# EAGLE design PolluxSensorBoard (EAGLE 6.1)
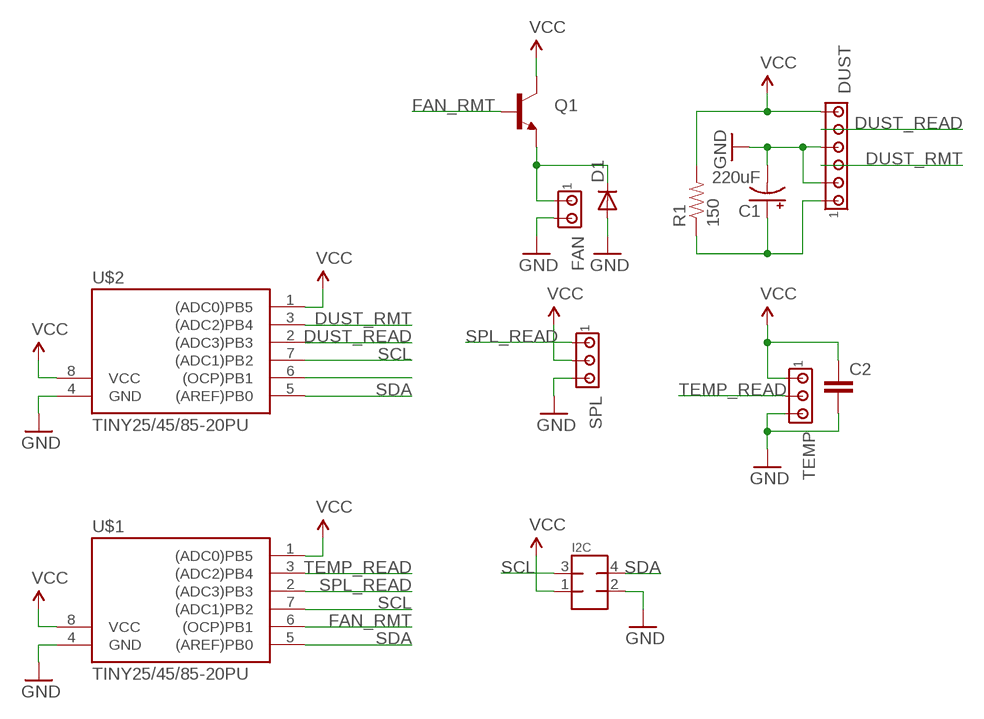
[diagram p0: schematic, sheet 1]

## Parts
C1  220uF  CAP_POLPTH4  [CPOL-RADIAL-1000UF-25V]
C2  CAPPTH1  [CAP-PTH-5MM]
D1  DIODEPTH  [DIODE-1N4001]
DUST  MTA06-100  [10X06MTA]
FAN  MTA02-100  [10X02MTA]
I2C  MMATCH-8-PTH  [AMP-215079-8]
Q1  TRANSISTOR_NPNTO-92-AMMO  [TO-92-AMMO]
R1  150  RESISTORPTH-1/4W  [AXIAL-0.4]
SPL  MTA03-100  [10X03MTA]
TEMP  MTA03-100  [10X03MTA]
U$1  TINY25/45/85-20PU  [DIL08]
U$2  TINY25/45/85-20PU  [DIL08]

## Nets
DUST_READ: DUST.2 U$2.2((ADC3)PB3)
DUST_RMT: DUST.4 U$2.3((ADC2)PB4)
FAN_RMT: Q1.2(B) U$1.6((OCP)PB1)
GND: C1.2(-) C2.2 D1.A DUST.3 DUST.5 FAN.2 I2C.2 SPL.3 TEMP.3 U$1.4(GND) U$2.4(GND)
N$1: D1.C FAN.1 Q1.1(E)
N$3: C1.1(+) DUST.6 R1.P$1
N$6: U$2.6((OCP)PB1)
SCL: I2C.3 U$1.7((ADC1)PB2) U$2.7((ADC1)PB2)
SDA: I2C.4 U$1.5((AREF)PB0) U$2.5((AREF)PB0)
SPL_READ: SPL.1 U$1.2((ADC3)PB3)
TEMP_READ: TEMP.2 U$1.3((ADC2)PB4)
VCC: C2.1 DUST.1 I2C.1 Q1.3(C) R1.P$2 SPL.2 TEMP.1 U$1.1((ADC0)PB5) U$1.8(VCC) U$2.1((ADC0)PB5) U$2.8(VCC)

## Library data of the parts
C1 = SparkFun:CAP_POL: Capacitor Polarized These are standard SMD and PTH capacitors. Normally 10uF, 47uF, and 100uF in electrolytic and tantalum varieties. Always verify the external diameter of the through hole cap, it varies with capacity, voltage, and manufacturer. The EIA devices should be standard.
C2 = SparkFun:CAP: Capacitor Standard 0603 ceramic capacitor, and 0.1" leaded capacitor.
D1 = SparkFun:DIODE: Diode These are standard reverse protection diodes and small signal diodes. SMA package can handle up to about 1A. SOD-323 can handle about 200mA. What the SOD-323 package when ordering, there are some mfgs out there that are 5-pin packages.
DUST = con-amp:MTA06-100: AMP connector
FAN = con-amp:MTA02-100: AMP connector
I2C = jt-con-micromatch:MMATCH-8-*: AMP Micromatch 8-pin
Q1 = SparkFun:TRANSISTOR_NPN: Transistor NPN BJT configuration in SOT23 package. MMBT2222 is the common NPN we use. Double check BCE configuration again layout.
R1 = SparkFun:RESISTOR: Resistor Basic schematic elements and footprints for 0603, 1206, and PTH resistors.
SPL TEMP = con-amp:MTA03-100: AMP connector
U$1 U$2 = avr-7:TINY25/45/85

## Board
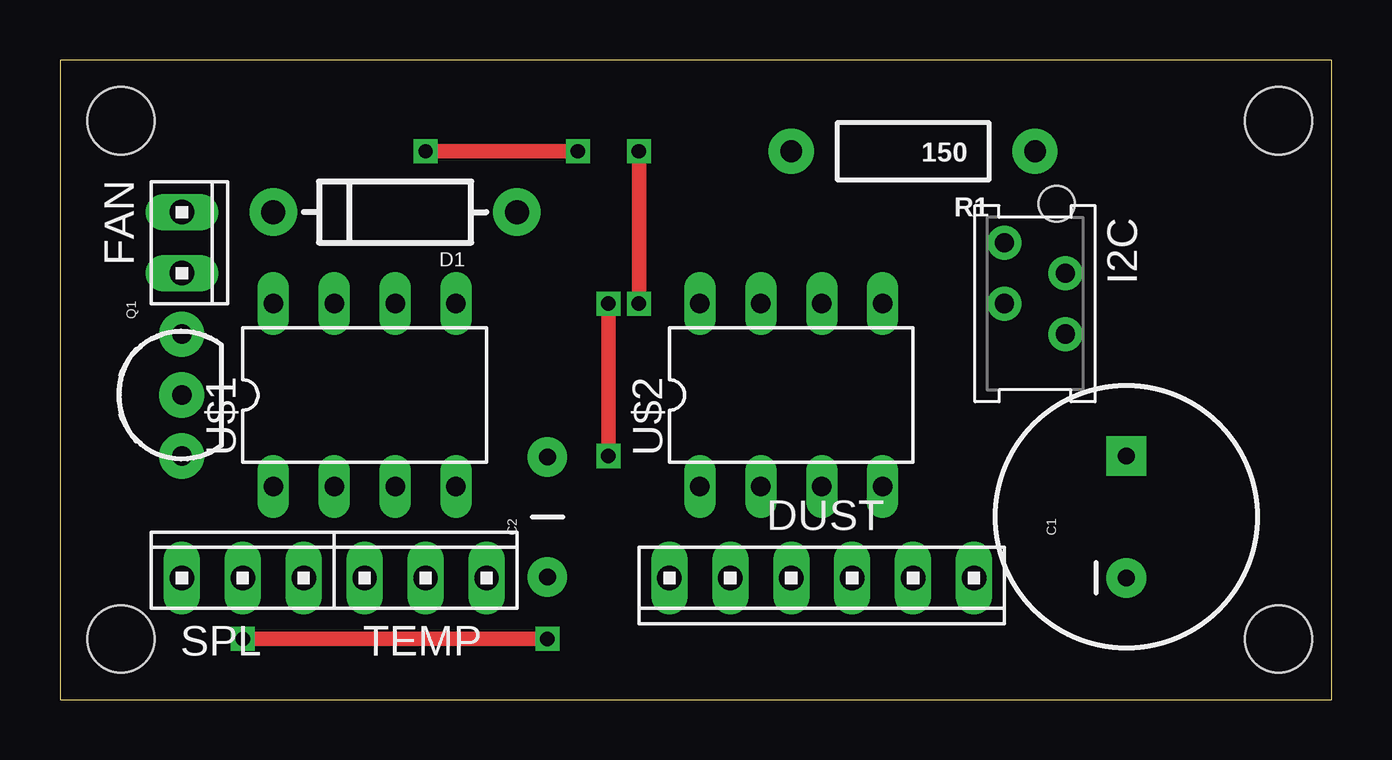
[diagram p1: board, top side]
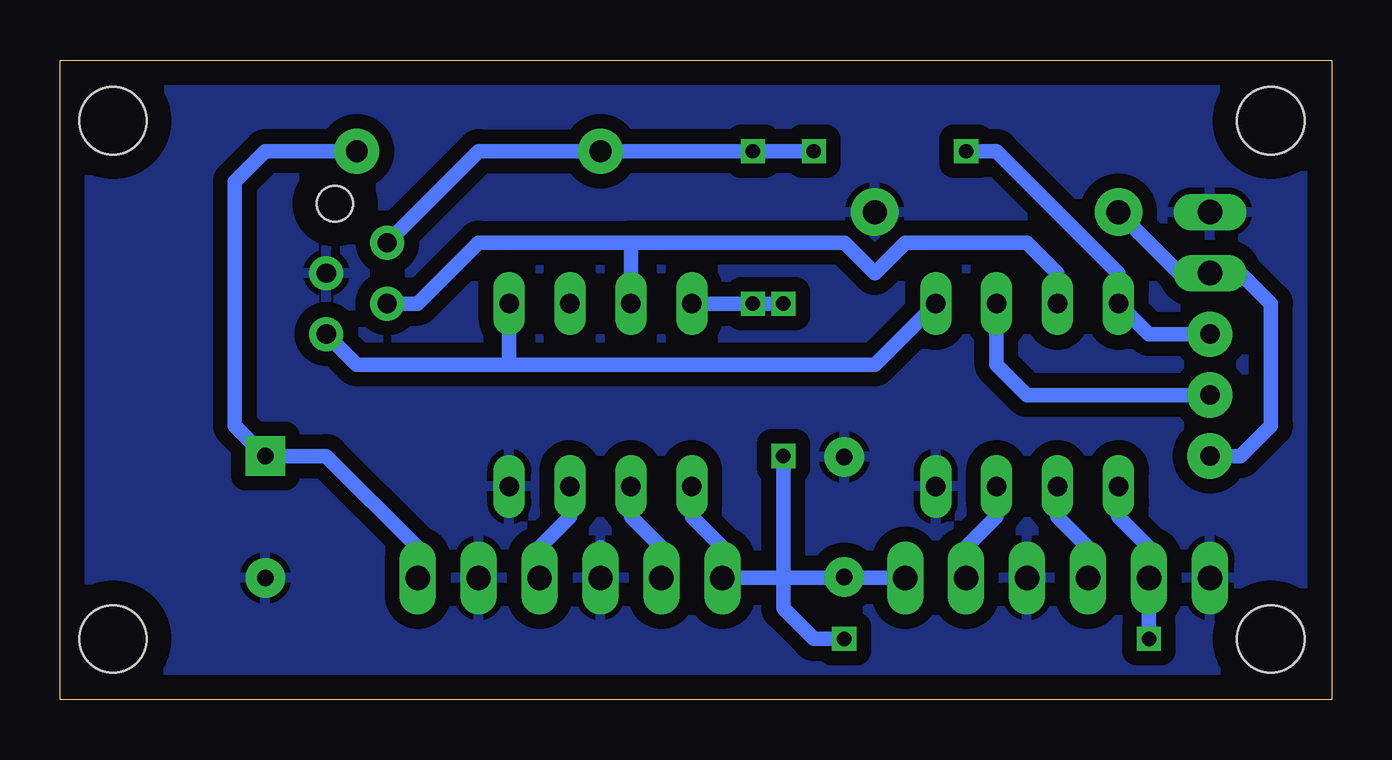
[diagram p2: board, bottom side, seen from below]

Size 53.01 x 26.66 mm. Coordinates in mm from the lower left corner, seen from the top.
Outline: 0,0 53.01,0 53.01,26.66 0,26.66 0,0
Copper layers (1*16): Top 0.035mm / dielectric 1.5mm / Bottom 0.035mm
Design rules: minimum track width 24mil, minimum drill 24mil, track to track 24mil, track to pad 24mil, pad to pad 8mil, via to via 8mil, smd to smd 24mil, copper to edge 40mil, drill to drill 8mil, minimum pad ring 10mil, minimum via ring 8mil, stop-mask expansion 4mil, vias tented up to drill 0mil, thermal gap 10mil
Holes 2.8 mm at 2.54,24.13 50.8,24.13 50.8,2.54 2.54,2.54

### Footprints (pad centres in the part's own frame; a part is rotated, then mirrored left to right if it is on the bottom)
CPOL-RADIAL-1000UF-25V = drill 0.7 pad 1.651 square: 1 2.54,0 | drill 0.7 pad 1.651: 2 -2.54,0
CAP-PTH-5MM = drill 0.7 pad 1.651: 1 -2.5,0; 2 2.5,0
DIODE-1N4001 = drill 1 pad 1.981: A -5.08,0; C 5.08,0
10X06MTA = drill 1.016 long: 1 6.35,0; 2 3.81,0; 3 1.27,0; 4 -1.27,0; 5 -3.81,0; 6 -6.35,0
10X02MTA = drill 1.016 long: 1 1.27,0; 2 -1.27,0
AMP-215079-8 = drill 0.8 pad 1.422: 1 0,-1.27; 2 1.27,1.27; 3 2.54,-1.27; 4 3.81,1.27 | hole 1.5: -1.62,0.905
TO-92-AMMO = drill 0.813 pad 1.88: 1 -2.54,0; 2 0,0; 3 2.54,0
AXIAL-0.4 = drill 0.9 pad 1.88: P$1 -5.08,0; P$2 5.08,0
10X03MTA = drill 1.016 long: 1 2.54,0; 2 0,0; 3 -2.54,0
DIL08 = drill 0.813 long: 1 -3.81,-3.81; 2 -1.27,-3.81; 3 1.27,-3.81; 4 3.81,-3.81; 5 3.81,3.81; 6 1.27,3.81; 7 -1.27,3.81; 8 -3.81,3.81

### Placement (x,y rotation side)
C1  44.45,7.62 90 top
C2  20.32,7.62 90 top
D1  13.97,20.32 180 top
DUST  31.75,5.08 180 top
FAN  5.08,19.05 270 top
I2C  40.64,19.05 270 top
Q1  5.08,12.7 90 top
R1  35.56,22.86 180 top
SPL  7.62,5.08 0 top
TEMP  15.24,5.08 0 top
U$1  12.7,12.7 0 top
U$2  30.48,12.7 0 top

### Tracks (layer width: path | path; a pad name or v marks a point on that pad's centre or on a via)
DUST_READ
  Bottom 0.61: DUST.2 27.94,6.35 29.21,7.62 U$2.2
DUST_RMT
  Bottom 0.61: U$2.3 31.75,7.62 33.02,6.35 DUST.4
FAN_RMT
  Bottom 0.61: Q1.2 12.7,12.7 13.97,13.97 U$1.6
GND
  Bottom 0.61: 30.48,6.35 DUST.3 30.53,5.13
  pour Bottom: 0,0 53.34,0 53.34,26.67 0,26.67
N$1
  Bottom 0.61: Q1.1 3.81,10.16 2.54,11.43 2.54,16.51 3.81,17.78 FAN.1 6.35,17.78 D1.C
N$3
  Bottom 0.61: DUST.6 38.1,6.35 41.91,10.16 C1.1 45.72,11.43 45.72,21.59 44.45,22.86 R1.P$1
SCL
  Bottom 0.61: U$1.7 11.43,17.78 12.7,19.05 17.78,19.05 19.05,17.78 20.32,19.05 29.21,19.05 | 29.21,19.05 U$2.7 | I2C.3 38.1,16.51 35.56,19.05 29.21,19.05
SDA
  Bottom 0.61: U$1.5 19.05,13.97 34.29,13.97 | U$2.5 34.29,13.97 | 34.29,13.97 40.64,13.97 I2C.4
SPL_READ
  Bottom 0.61: U$1.2 11.43,7.62 10.16,6.35 SPL.1
TEMP_READ
  Bottom 0.61: U$1.3 13.97,7.62 15.24,6.35 TEMP.2
VCC  (via drill 0.6)
  Top 0.61: v15.24,22.86 v21.59,22.86 | v24.13,16.51 v24.13,22.86 | v22.86,10.16 v22.86,16.51 | v7.62,2.54 v20.32,2.54
  Bottom 0.61: v21.59,22.86 v24.13,22.86 R1.P$2 35.56,22.86 I2C.1 | U$2.8 v24.13,16.51 v22.86,16.51 | 22.86,5.08 v22.86,10.16 | 22.86,5.08 DUST.1 25.4,6.35 26.67,7.62 U$2.1 | TEMP.1 20.32,5.08 | 20.32,5.08 22.86,5.08 | C2.1 20.32,5.08 | v15.24,22.86 13.97,22.86 8.89,17.78 U$1.8 7.62,15.24 Q1.3 | U$1.1 8.89,7.62 7.62,6.35 SPL.2 v7.62,2.54 | v20.32,2.54 21.59,2.54 22.86,3.81 22.86,5.08